# EAGLE design Pure Digit (EAGLE 9.6.2)

## Sheet 1 of 4: Microprocessor
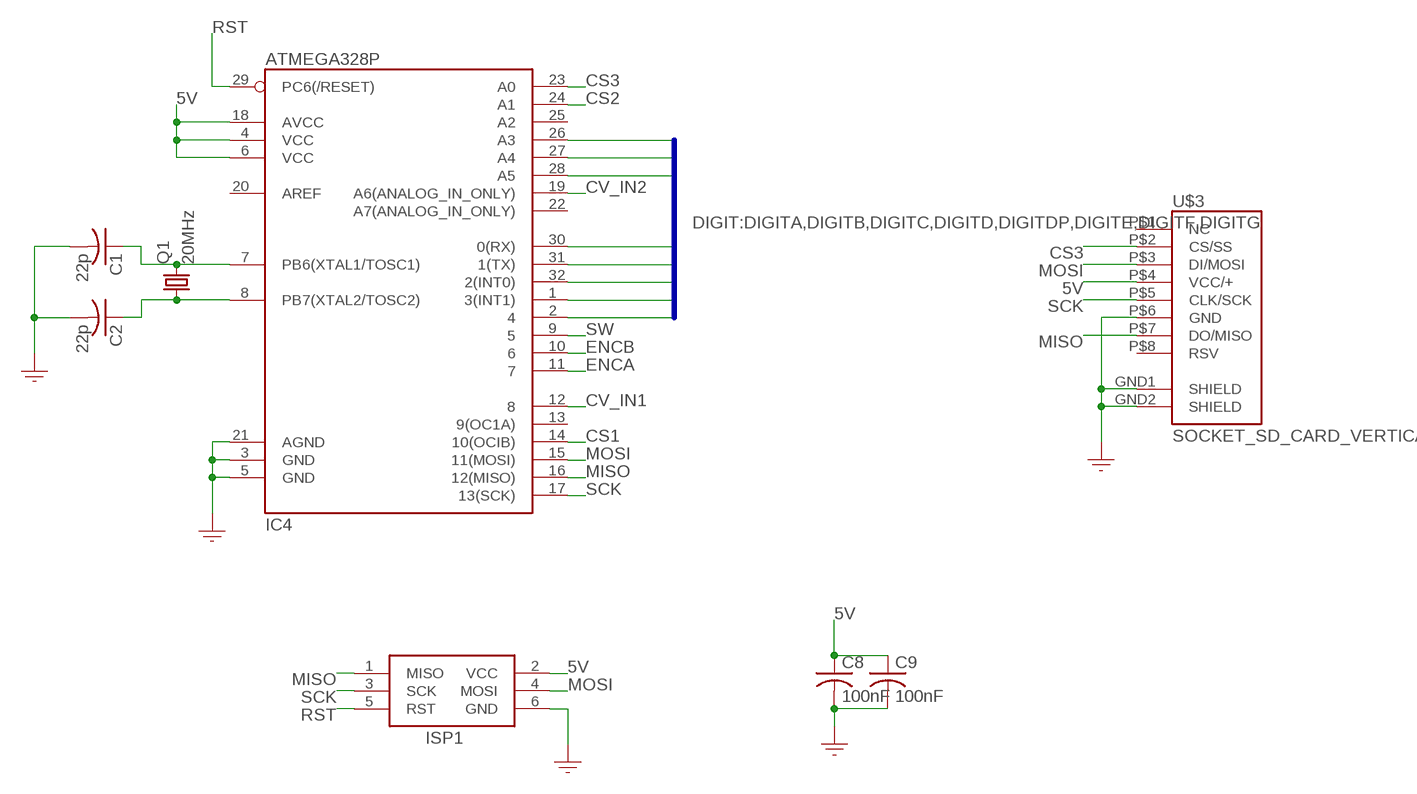
[diagram p0: schematic, sheet 1]

### Parts
C1  22p  CAPACITOR-USC0805  [C0805]
C2  22p  CAPACITOR-USC0805  [C0805]
C8  100nF  CAPACITOR-USC0805  [C0805]
C9  100nF  CAPACITOR-USC0805  [C0805]
IC4  ATMEGA328P  MICROPROCESSOR_ATMEGA328_SMT  [TQFP32-08]
ISP1  HEADER2X3-6  [AVRISP]
Q1  20MHz  CRYSTALSM49  [SM49]
U$3  SOCKET_SD_CARD_VERTICAL  [PJS008U-3000]

### Nets
5V: C8.1 C9.1 IC4.4(VCC) IC4.6(VCC) IC4.18(AVCC) ISP1.2(VCC) U$3.P$4(VCC/+) ; also sheet 2,3,4
CS1: IC4.14(10(OCIB)) ; also sheet 4
CS2: IC4.24(A1) ; also sheet 3
CS3: IC4.23(A0) U$3.P$2(CS/SS)
CV_IN1: IC4.12 ; also sheet 3
CV_IN2: IC4.19(A6(ANALOG_IN_ONLY)) ; also sheet 3
DIGITA: IC4.30(0(RX)) ; also sheet 4
DIGITB: IC4.28(A5) ; also sheet 4
DIGITC: IC4.27(A4) ; also sheet 4
DIGITD: IC4.26(A3) ; also sheet 4
DIGITDP: IC4.1(3(INT1)) ; also sheet 4
DIGITE: IC4.2 ; also sheet 4
DIGITF: IC4.32(2(INT0)) ; also sheet 4
DIGITG: IC4.31(1(TX)) ; also sheet 4
ENCA: IC4.11 ; also sheet 3
ENCB: IC4.10 ; also sheet 3
GND: C1.2 C2.2 C8.2 C9.2 IC4.3(GND) IC4.5(GND) IC4.21(AGND) ISP1.6(GND) U$3.GND1(SHIELD) U$3.GND2(SHIELD) U$3.P$6(GND) ; also sheet 2,3,4
MISO: IC4.16(12(MISO)) ISP1.1(MISO) U$3.P$7(DO/MISO) ; also sheet 3
MOSI: IC4.15(11(MOSI)) ISP1.4(MOSI) U$3.P$3(DI/MOSI) ; also sheet 3,4
N$1: C1.1 IC4.7(PB6(XTAL1/TOSC1)) Q1.2
N$2: C2.1 IC4.8(PB7(XTAL2/TOSC2)) Q1.1
RST: IC4.29(PC6(/RESET)) ISP1.5(RST)
SCK: IC4.17(13(SCK)) ISP1.3(SCK) U$3.P$5(CLK/SCK) ; also sheet 3,4
SW: IC4.9 ; also sheet 3
Unconnected: IC4.13(9(OC1A)) IC4.20(AREF) IC4.22(A7(ANALOG_IN_ONLY)) IC4.25(A2) U$3.P$1(NC) U$3.P$8(RSV)

### Buses
DIGIT:DIGITA,DIGITB,DIGITC,DIGITD,DIGITDP,DIGITE,DIGITF,DIGITG

## Sheet 2 of 4: Power
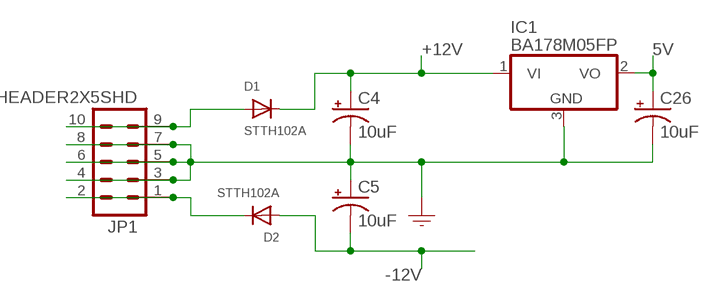
[diagram p1: schematic, sheet 2]

### Parts
C4  10uF  CAPACITOR_POL-US153CLV-0505  [153CLV-0505]
C5  10uF  CAPACITOR_POL-US153CLV-0505  [153CLV-0505]
C26  10uF  CAPACITOR_POL-US153CLV-0505  [153CLV-0505]
D1  STTH102A  DIODESMA  [SMADIODE]
D2  STTH102A  DIODESMA  [SMADIODE]
IC1  BA178M05FP  VOLTAGE_REG_POS05DT  [TO252]
JP1  HEADER2X5SHD  [2X5-SHROUDED]

### Nets
5V: C26.+ IC1.2(VO) ; also sheet 1,3,4
+12V: C4.+ D1.C IC1.1(VI) ; also sheet 3
-12V: C5.- D2.A ; also sheet 3
GND: C4.- C5.+ C26.- IC1.3(GND) JP1.3 JP1.4 JP1.5 JP1.6 JP1.7 JP1.8 ; also sheet 1,3,4
N$9: D1.A JP1.9 JP1.10
N$10: D2.C JP1.1 JP1.2

## Sheet 3 of 4: Inputs
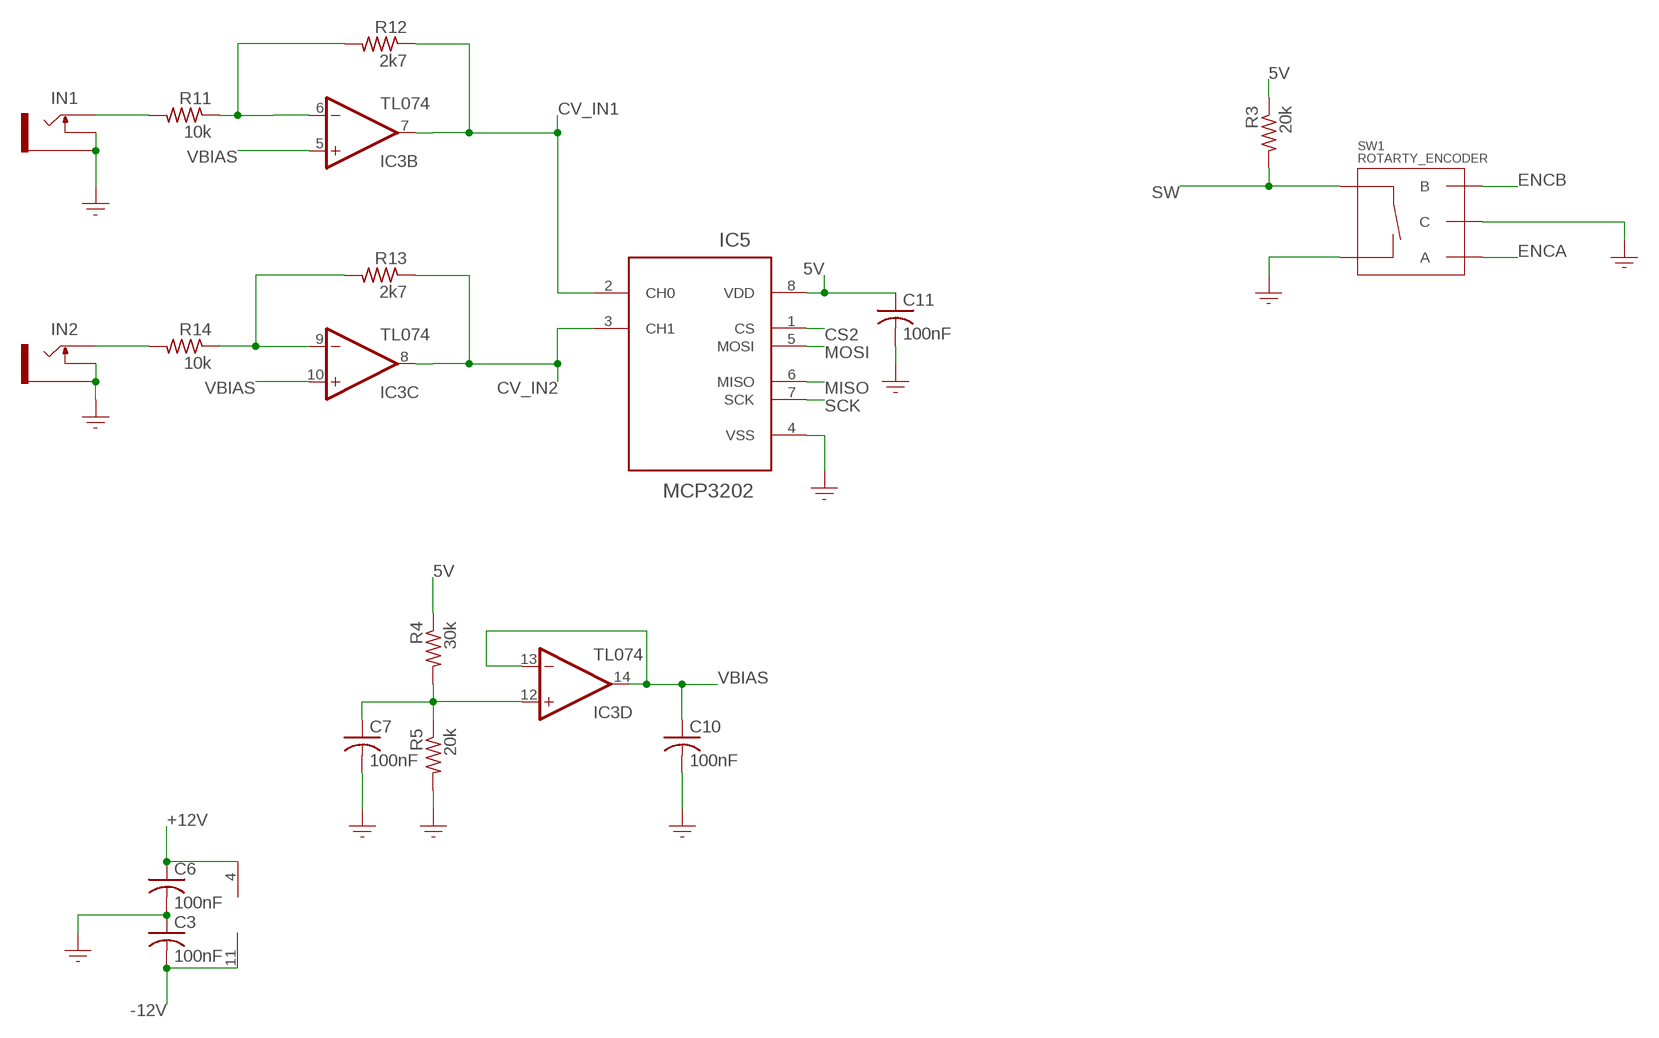
[diagram p2: schematic, sheet 3]

### Parts
C3  100nF  CAPACITOR-USC0805  [C0805]
C6  100nF  CAPACITOR-USC0805  [C0805]
C7  100nF  CAPACITOR-USC0805  [C0805]
C10  100nF  CAPACITOR-USC0805  [C0805]
C11  100nF  CAPACITOR-USC0805  [C0805]
IC3  TL074  OPAMP_QUADD  [SO14]
IC5  MCP3202  ADC_DUAL_12B_MCP3202  [SOIC--8]
IN1  PJ301M-12  SOCKET_MONO_3.5MMPJ301M-12  [PJ301M-12]
IN2  PJ301M-12  SOCKET_MONO_3.5MMPJ301M-12  [PJ301M-12]
R3  20k  RESISTOR_USR0805  [R0805]
R4  30k  RESISTOR_USR0805  [R0805]
R5  20k  RESISTOR_USR0805  [R0805]
R11  10k  RESISTOR_USR0805  [R0805]
R12  2k7  RESISTOR_USR0805  [R0805]
R13  2k7  RESISTOR_USR0805  [R0805]
R14  10k  RESISTOR_USR0805  [R0805]
SW1  ROTARTY_ENCODER  [ROTARY_ENC_PLAIN]

### Nets
5V: C11.1 IC5.8(VDD) R3.1 R4.1 ; also sheet 1,2,4
+12V: C6.1 IC3.4(P:V+) ; also sheet 2
-12V: C3.2 IC3.11(P:V-) ; also sheet 2
CS2: IC5.1(CS) ; also sheet 1
CV_IN1: IC3.7(B:OUT) IC5.2(CH0) R12.1 ; also sheet 1
CV_IN2: IC3.8(C:OUT) IC5.3(CH1) R13.1 ; also sheet 1
ENCA: SW1.A ; also sheet 1
ENCB: SW1.B ; also sheet 1
GND: C3.1 C6.2 C7.2 C10.2 C11.2 IC5.4(VSS) IN1.GND(SLEEVE) IN1.NORM(SWITCH) IN2.GND(SLEEVE) IN2.NORM(SWITCH) R5.2 SW1.C SW1.SW- ; also sheet 1,2,4
MISO: IC5.6(MISO) ; also sheet 1
MOSI: IC5.5(MOSI) ; also sheet 1,4
N$8: IN1.TIP R11.2
N$11: IN2.TIP R14.2
N$12: C7.1 IC3.12(D:+IN) R4.2 R5.1
N$20: IC3.6(B:-IN) R11.1 R12.2
N$24: IC3.9(C:-IN) R13.2 R14.1
SCK: IC5.7(SCK) ; also sheet 1,4
SW: R3.2 SW1.SW+ ; also sheet 1
VBIAS: C10.1 IC3.5(B:+IN) IC3.10(C:+IN) IC3.13(D:-IN) IC3.14(D:OUT)

## Sheet 4 of 4: Outputs
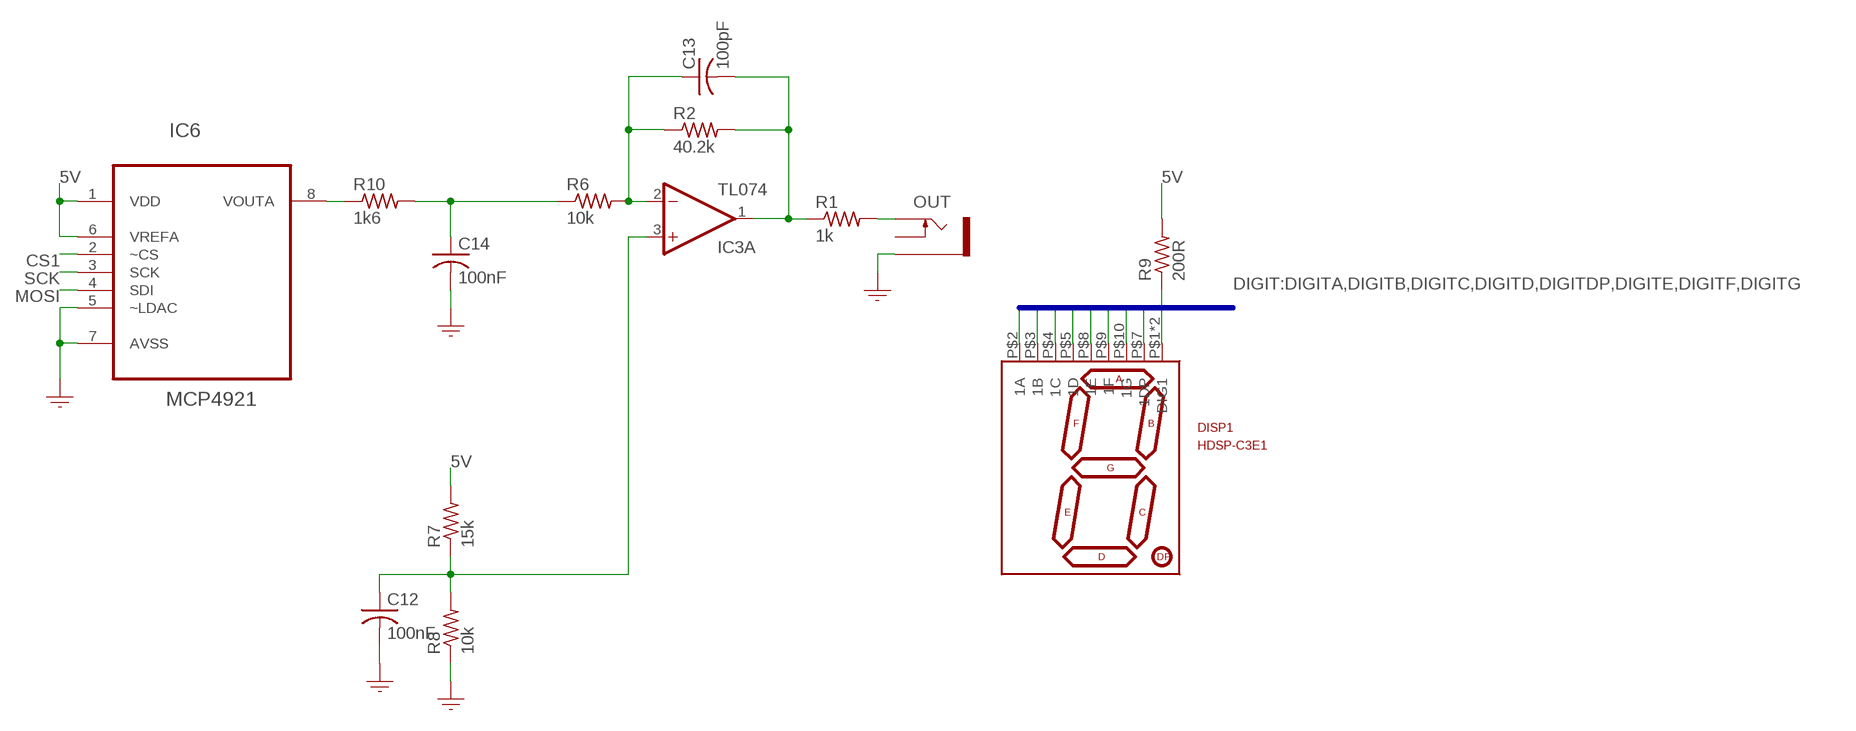
[diagram p3: schematic, sheet 4]

### Parts
C12  100nF  CAPACITOR-USC0805  [C0805]
C13  100pF  CAPACITOR-USC0805  [C0805]
C14  100nF  CAPACITOR-USC0805  [C0805]
DISP1  HDSP-C3E1  DISPLAY_7-SEGMENT-1DIGIT  [7-SEGMENT-1DIGIT]
IC6  MCP4921  DAC_SINGLE_12B_MCP4921  [SOIC8]
OUT  PJ301M-12  SOCKET_MONO_3.5MMPJ301M-12  [PJ301M-12]
R1  1k  RESISTOR_USR0805  [R0805]
R2  40.2k  RESISTOR_USR0805  [R0805]
R6  10k  RESISTOR_USR0805  [R0805]
R7  15k  RESISTOR_USR0805  [R0805]
R8  10k  RESISTOR_USR0805  [R0805]
R9  200R  RESISTOR_USR0805  [R0805]
R10  1k6  RESISTOR_USR0805  [R0805]

### Nets
5V: IC6.1(VDD) IC6.6(VREFA) R7.2 R9.2 ; also sheet 1,2,3
CS1: IC6.2(~CS) ; also sheet 1
DIGITA: DISP1.P$2(1A) ; also sheet 1
DIGITB: DISP1.P$3(1B) ; also sheet 1
DIGITC: DISP1.P$4(1C) ; also sheet 1
DIGITD: DISP1.P$5(1D) ; also sheet 1
DIGITDP: DISP1.P$7(1DP) ; also sheet 1
DIGITE: DISP1.P$8(1E) ; also sheet 1
DIGITF: DISP1.P$9(1F) ; also sheet 1
DIGITG: DISP1.P$10(1G) ; also sheet 1
GND: C12.2 C14.2 IC6.5(~LDAC) IC6.7(AVSS) OUT.GND(SLEEVE) R8.1 ; also sheet 1,2,3
MOSI: IC6.4(SDI) ; also sheet 1,3
N$3: C12.1 IC3.3(A:+IN) R7.1 R8.2
N$4: C13.2 IC3.1(A:OUT) R1.1 R2.2
N$5: OUT.TIP R1.2
N$6: C14.1 R6.1 R10.2
N$7: C13.1 IC3.2(A:-IN) R2.1 R6.2
N$13: DISP1.P$1(DIG1) DISP1.P$6(DIG1) R9.1
N$14: IC6.8(VOUTA) R10.1
SCK: IC6.3(SCK) ; also sheet 1,3
Unconnected: OUT.NORM(SWITCH)

### Buses
DIGIT:DIGITA,DIGITB,DIGITC,DIGITD,DIGITDP,DIGITE,DIGITF,DIGITG

## Library data of the parts
C1-C3 C6-C14 = GMSN:CAPACITOR-US: Capacitor; SORT: 3
C4 C5 C26 = GMSN:CAPACITOR_POL-US: Electro Capacitor; SORT: 3
D1 D2 = GMSN:DIODE: Diode SMADIODE - SMA Surface Mount Package 20V 1A Schottky Diode Digikey: 641-1014-6-ND DO-1N4148 - Through Hole Small Current Diode SOD-123 20V 1 A (.5mV Vf) Schottky Diode - Digikey: MBRX120TPMSCT-ND SOD-323 10V 570mA (.38mV Vf, 3ns) Schottky Diode - Digikey: ZLLS410CT-ND SOD-523 30V 30mA Schottky Diode (RB751S-40TE61) - Digikey: RB751S-40TE61CT-ND SOT23-R/W - SOT23 Package (R = Solder Paste/Reflow Ovens, W = Hand-Soldering) BAT54Film 40V 300mA - Digikey: 497-7162-1-ND; SORT: 3.9
DISP1 = GMSN:DISPLAY_7-SEGMENT-1DIGIT: 1 Digit 7 Segment Display - Common Anode; SORT: 9
IC1 = GMSN:VOLTAGE_REG_POS: Positive Voltage Regulator Added bigger pads to the TO-92 package; SORT: 4
IC3 = GMSN:OPAMP_QUAD: OP AMP; SORT: 4.5
IC4 = GMSN:MICROPROCESSOR_ATMEGA328_SMT: 32-Pin ATMEGA328 Commonly used on Arduino compatible boards Available in QFP and QFN packages TQFP is IC-09069 QFN is non-stock; SORT: 4
IC5 = GMSN:ADC_DUAL_12B_MCP3202: 12bit 2Ch ADC; SORT: 4
IC6 = GMSN:DAC_SINGLE_12B_MCP4921: 12bit DAC; SORT: 4
IN1 IN2 OUT = GMSN:SOCKET_MONO_3.5MM: 3.5 mm Jack Socket; SORT: 8
ISP1 = GMSN:HEADER2X3: AVR ISP Header Standard 6 pin header for AVR programming; SORT: 7
JP1 = GMSN:HEADER2X5: Header 5x2 Standard 10-pin dual row 0.1" header. Commonly used with AVR-ISP. Use with Spark Fun Electronics SKU: PRT-00778; SORT: 7
Q1 = GMSN:CRYSTAL: Crystal; SORT: 6
R1-R14 = GMSN:RESISTOR_US: Resistor; SORT: 2
SW1 = GMSN:ROTARTY_ENCODER: Simple no LED rotary encoder Example: COM-09117; SORT: 8
U$3 = GMSN:SOCKET_SD_CARD_VERTICAL

## Board
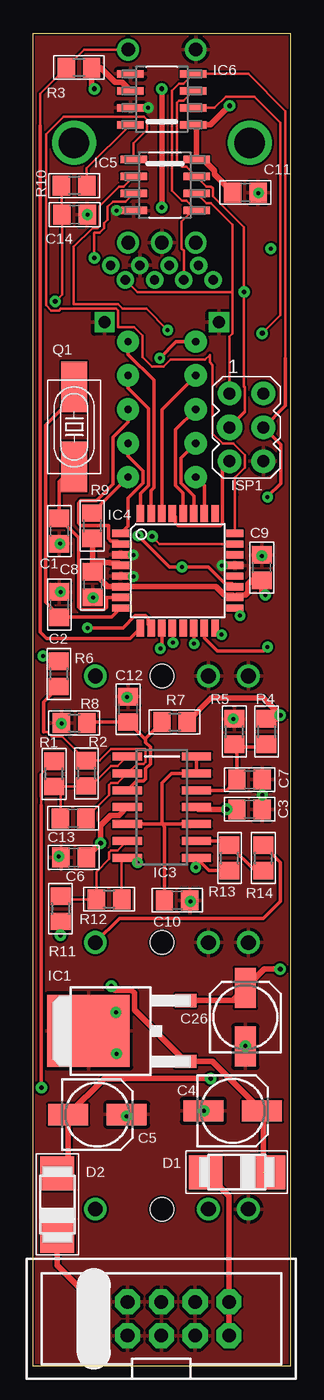
[diagram p4: board, top side]
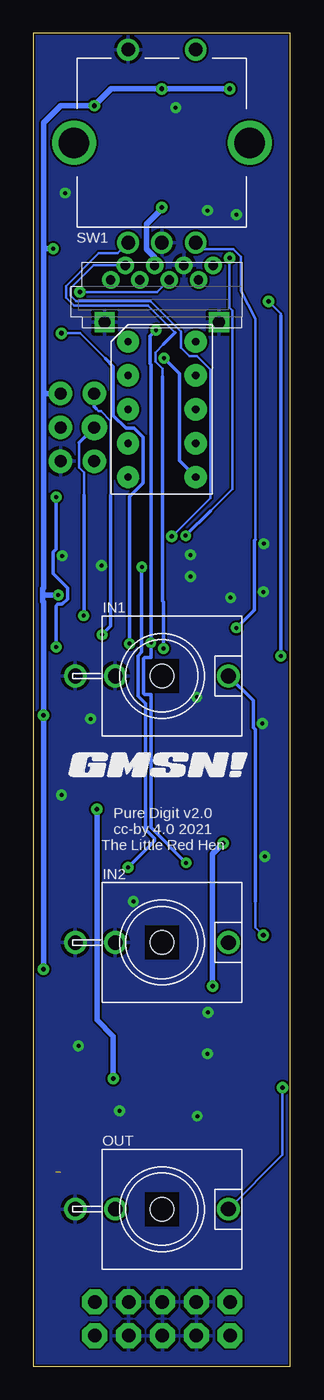
[diagram p5: board, bottom side, seen from below]

Size 19.32 x 99.99 mm. Coordinates in mm from the lower left corner, seen from the top.
Outline: 19.32,0 0,0 0,99.99 19.32,99.99 19.32,0
Copper layers (1*16): Top 0.035mm / dielectric 1.5mm / Bottom 0.035mm
Design rules "PCBWay": minimum track width 6mil, minimum drill 12mil, track to track 6mil, track to pad 6mil, pad to pad 6mil, via to via 6mil, smd to smd 6mil, copper to edge 6mil, drill to drill 6mil, minimum pad ring 12mil, minimum via ring 10mil, stop-mask expansion 4mil, vias tented up to drill 25mil, thermal gap 10mil

### Footprints (pad centres in the part's own frame; a part is rotated, then mirrored left to right if it is on the bottom)
C0805 = smd 1.3 x 1.5: 1 -0.95,0; 2 0.95,0
153CLV-0505 = smd 3 x 1.6: + 2.2,0; - -2.2,0
SMADIODE = smd 2.54 x 2.54: A 2.349,0; C -2.349,0
7-SEGMENT-1DIGIT = drill 0.55 pad 1.676: P$1 -2.54,5.08; P$2 -2.54,2.54; P$3 -2.54,0; P$4 -2.54,-2.54; P$5 -2.54,-5.08; P$6 2.54,-5.08; P$7 2.54,-2.54; P$8 2.54,0; P$9 2.54,2.54; P$10 2.54,5.08
TO252 = smd 1 x 1.6: 1 -2.28,-4.8; 2 2.28,-4.8 | smd 5.4 x 6.2: 3 0,2.5
SO14 = smd 0.6 x 2.2: 1 -3.81,-2.6; 2 -2.54,-2.6; 3 -1.27,-2.6; 4 0,-2.6; 5 1.27,-2.6; 6 2.54,-2.6; 7 3.81,-2.6; 8 3.81,2.6; 9 2.54,2.6; 10 1.27,2.6; 11 0,2.6; 12 -1.27,2.6; 13 -2.54,2.6; 14 -3.81,2.6
TQFP32-08 = smd 1.27 x 0.559: 1 -4.293,2.8; 2 -4.293,2; 3 -4.293,1.2; 4 -4.293,0.4; 5 -4.293,-0.4; 6 -4.293,-1.2; 7 -4.293,-2; 8 -4.293,-2.8; 17 4.293,-2.8; 18 4.293,-2; 19 4.293,-1.2; 20 4.293,-0.4; 21 4.293,0.4; 22 4.293,1.2; 23 4.293,2; 24 4.293,2.8 | smd 0.559 x 1.27: 9 -2.8,-4.293; 10 -2,-4.293; 11 -1.2,-4.293; 12 -0.4,-4.293; 13 0.4,-4.293; 14 1.2,-4.293; 15 2,-4.293; 16 2.8,-4.293; 25 2.8,4.293; 26 2,4.293; 27 1.2,4.293; 28 0.4,4.293; 29 -0.4,4.293; 30 -1.2,4.293; 31 -2,4.293; 32 -2.8,4.293
SOIC--8 = smd 1.981 x 0.559: 1 -2.362,1.905; 2 -2.362,0.635; 3 -2.362,-0.635; 4 -2.362,-1.905; 5 2.362,-1.905; 6 2.362,-0.635; 7 2.362,0.635; 8 2.362,1.905
SOIC8 = smd 1.981 x 0.559: 1 -2.362,1.905; 2 -2.362,0.635; 3 -2.362,-0.635; 4 -2.362,-1.905; 5 2.362,-1.905; 6 2.362,-0.635; 7 2.362,0.635; 8 2.362,1.905
PJ301M-12 = drill 1.1: GND 0,-6.5; NORM 0,-3.5; TIP 0,5 | hole 1.778: 0,0
AVRISP = drill 0.9 pad 1.778: 1 -1.27,2.54; 2 1.27,2.54; 4 1.27,0; 5 -1.27,-2.54; 6 1.27,-2.54 | drill 0.9 pad 1.93: 3 -1.27,0
2X5-SHROUDED = drill 1.016 pad 1.88 octagon: 1 -1.27,5.08; 2 1.27,5.08; 3 -1.27,2.54; 4 1.27,2.54; 5 -1.27,0; 6 1.27,0; 7 -1.27,-2.54; 8 1.27,-2.54; 9 -1.27,-5.08; 10 1.27,-5.08
SM49 = smd 3.81 x 1.93: 1 -3,0; 2 3,0
R0805 = smd 1.3 x 1.5: 1 -0.95,0; 2 0.95,0
ROTARY_ENC_PLAIN = drill 1.016: A 7.493,-2.54; B 7.493,2.54; C 7.493,0; SW+ -6.985,2.54; SW- -6.985,-2.54 | drill 2.286: P$3 0,6.604; P$4 0,-6.604
PJS008U-3000 = drill 0.9 square: GND1 -4.3,-1.519; GND2 4.3,-1.519 | drill 0.7: P$1 -3.85,1.651; P$2 -2.75,2.751; P$3 -1.65,1.651; P$4 -0.55,2.751; P$5 0.55,1.651; P$6 1.65,2.751; P$7 2.75,1.651; P$8 3.85,2.751

### Placement (x,y rotation side)
C1  1.96,62.65 270 top
C2  1.96,57.13 90 top
C3  16.25,41.78 180 top
C4  14.98,19.15 0 top
C5  4.82,18.88 0 top
C6  3.03,38.16 180 top
C7  16.25,44 0 top
C8  4.46,58.64 270 top
C9  17.16,59.91 90 top
C10  10.81,34.95 0 top
C11  15.93,88.05 0 top
C12  7.12,49.28 90 top
C13  2.99,41.1 180 top
C14  3.11,86.38 0 top
C26  15.93,26.18 90 top
D1  15.3,14.55 180 top
D2  1.8,12.13 90 top
DISP1  9.66,71.78 0 bottom
IC1  6.64,25.15 90 top
IC3  9.66,41.93 270 top
IC4  10.85,59.67 0 top
IC5  9.9,88.61 0 top
IC6  9.66,95.04 180 top
IN1  9.66,51.78 270 bottom
IN2  9.66,31.78 270 bottom
ISP1  16.01,70.43 0 top
JP1  9.62,3.56 90 top
OUT  9.66,11.78 270 bottom
Q1  3.07,70.47 270 top
R1  1.56,44.43 90 top
R2  3.98,44.47 270 top
R3  3.43,97.42 180 top
R4  17.52,47.61 270 top
R5  15.1,47.61 90 top
R6  1.92,51.94 270 top
R7  10.61,48.32 0 top
R8  3.07,48.24 0 top
R9  4.42,63.05 270 top
R10  3.07,88.57 180 top
R11  2.04,34.31 270 top
R12  5.69,35.03 180 top
R13  14.74,38.12 90 top
R14  17.28,38.12 90 top
SW1  9.66,91.78 270 bottom
U$1  [GMSN!_LOGO]  9.66,45.03 0 bottom
U$3  9.66,79.83 0 bottom

### Tracks (layer width: path | path; a pad name or v marks a point on that pad's centre or on a via)
5V  (via drill 0.3, 0.35)
  Top 0.406: R9.2 4.46,62.06 4.46,60.27 | 4.46,60.27 C8.1 5.36,58.7 5.57,58.49 5.58,58.47 IC4.6 7.94,58.47 7.96,58.49 13.71,58.49 14.36,57.84 14.98,57.84 IC4.18 15.31,57.84 15.93,57.84 16.13,58.05 16.13,58.67 16.43,58.96 C9.1 17.16,58.13 v17.44,57.85 | IC4.4 6.39,60.24 5.78,60.24 5.75,60.27 4.46,60.27 | R4.1 18.27,48.56 v18.55,48.84 17.28,50.11 13.35,50.11 R7.2 | IC1.2 14.98,27.43 C26.+ 17.34,29.79 v18.55,29.79 | v14.74,94.56 13.31,93.13 IC6.1 12.26,92.89 IC5.8 12.76,90.51 13.61,89.67 13.61,89.42 C11.1 | IC6.6 6.66,96.31 6.16,96.31 5.05,97.42 R3.1 4.38,96.03 v4.58,95.83 | v9.66,86.94 v9.66,95.83
  Bottom 0.254: 18.55,57.85 18.55,58.28 18.61,58.33
  Bottom 0.406: v18.55,29.79 v18.55,48.84 18.55,57.31 18.61,57.37 18.61,58.33 18.55,58.39 18.55,72.97 | 18.55,72.97 18.55,83.92 | 18.55,83.92 18.55,93.29 17.28,94.56 v14.74,94.56 13.47,95.83 v9.66,95.83 v4.58,95.83 | 18.55,72.97 ISP1.2 | v17.84,83.84 18.47,83.84 18.55,83.92 | v17.44,57.85 18.55,57.85 | v9.66,86.94 9.66,86.84 10.83,85.67 10.83,83.8 10.21,83.19 U$3.P$4
+12V  (via drill 0.35)  (1 unrouted)
  Top 0.406: IC3.4 6.45,41.32 5.81,41.32 5.06,40.56 v5.06,39.24 C6.1 | v5.85,28.52 6.17,28.2 7.39,28.2 7.6,27.99 7.6,26.71 IC1.1 13.46,22.87 C4.+ 17.28,19.05 17.28,14.55
  Bottom 0.406: v5.85,28.52 5.85,31.26 5.87,31.28 5.87,38.42 v5.06,39.24
-12V  (via drill 0.35)
  Top 0.406: C3.2 v14.54,41.78 12.42,41.78 IC3.11 | D2.A 2.62,15.3 C5.- 5.31,21.57 6.84,21.57 6.84,21.58 v13.31,21.58
  Bottom 0.406: v14.54,41.78 14.54,25.98 13.31,24.75 v13.31,21.58
CS1  (via drill 0.3, 0.35)
  Top 0.2: IC6.2 13.62,94.4 14.46,95.24 16.6,95.24 18.55,93.29 18.55,78.84 v17.2,77.49
  Top 0.254: v12.08,54.2 12.08,55.35 IC4.14
  Bottom 0.2: 13.91,75.59 15.81,77.49 v17.2,77.49
  Bottom 0.254: 13.91,75.59 13.32,75 13.32,71.32 12.36,70.36 11.74,70.36 11.08,69.7 11.08,66.24 12.08,65.24 v12.08,54.2
CS2
  Top 0.2: 15.14,65.35 15.14,66.68 15.88,67.42 15.88,68.36 15.03,69.21 14.24,69.21 13.47,69.98 13.47,71.7 | 13.25,75.86 12.9,75.51 10.31,75.51 9.77,74.97 8.93,74.97 8.21,75.69 8.21,77.31 7.57,77.95 6.37,77.95 6.37,79.17 6.22,79.32 2.05,79.32 1.92,79.19 1.36,79.19 0.96,79.59 0.96,92.41 2.28,93.73 8.33,93.73 8.54,93.52 8.54,92.75 7.54,91.74 IC5.1
  Top 0.203: IC4.24 15.14,65.35 | 13.25,75.86 13.25,75.32 13.47,75.09 13.47,71.7
CS3  (via drill 0.35)
  Top 0.2: IC4.23 9.49,61.67 v8.92,62.25
  Bottom 0.2: v8.92,62.25 6.03,65.14 6.03,74.77 7.03,75.77 7.57,75.77 8.21,76.41 8.21,77.61 10.51,79.91 16.11,79.91 16.51,80.31 16.51,80.87 14.8,82.58 U$3.P$2
CV_IN1  (via drill 0.3)
  Top 0.2: R12.1 6.64,37.84 6.92,38.12 | v10.1,77.73 8.51,79.32 6.72,79.32 6.37,79.67 3.04,79.67 3.04,83.98 4.45,85.38 4.82,85.38 4.96,85.53 4.96,87.03 6.44,88.5 6.8,88.5 IC5.2
  Top 0.254: 6.92,38.12 IC3.7 7.48,38.12 v7.83,37.77 | v10.49,54.28 10.49,55.34 IC4.12
  Bottom 0.254: v7.83,37.77 10.49,40.43 10.49,50.38 10.98,50.38 11.06,50.46 11.06,53.1 10.98,53.18 10.49,53.18 v10.49,54.28 10.49,59.66 10.48,59.67 10.48,75.15 10.54,75.2 10.54,77.29 v10.1,77.73
CV_IN2  (via drill 0.3, 0.35)
  Top 0.2: v4.58,83.13 4.58,85.02 4.59,85.03 4.96,85.03 5.32,85.38 5.32,85.75 5.59,86.03 5.59,86.97 5.97,87.36 6.92,87.36 IC5.3
  Top 0.254: R13.1 13.21,37.17 12.39,38 | 12.39,38 IC3.8 | IC4.19 14.9,58.72 14.39,58.72 13.16,59.95 v11.17,59.95 10.22,59.95 v7.87,62.29 | v12.2,37.41 12.39,37.6 12.39,38
  Bottom 0.2: v4.58,83.13 4.58,79.4 4.35,79.17 4.35,65.81 6,64.17
  Bottom 0.254: v7.87,62.29 6,64.17 | v12.2,37.41 10.22,39.39 10.22,39.57 10.9,40.26 10.9,49.72 11.46,50.29 11.46,53.27 11.18,53.56 v11.18,59.94 v11.17,59.95
DIGITA
  Top 0.254: DISP1.P$2 9.65,71.77 IC4.30
DIGITB
  Top 0.254: IC4.28 11.25,65.49 10.68,66.07 10.68,70.26 DISP1.P$3
DIGITC
  Top 0.254: IC4.27 12.05,65.27 11.08,66.24 11.08,68.12 DISP1.P$4
DIGITD
  Top 0.254: IC4.26 12.85,66.05 DISP1.P$5
DIGITDP
  Top 0.254: IC4.1 7.12,63.04 7.12,65.12 8.24,66.24 8.24,67.16 7.12,68.28 DISP1.P$7
DIGITE
  Top 0.254: DISP1.P$8 7.12,70.82 6,69.7 6,66.16 4.77,64.93 3.56,64.93 3.39,64.76 3.39,63.23 3.56,63.07 5.64,63.07 5.64,62.08 5.81,61.92 6.32,61.92 IC4.2
DIGITF
  Top 0.254: DISP1.P$9 7.12,73.36 8.64,71.84 8.64,66.07 8.05,65.47 IC4.32
DIGITG
  Top 0.254: DISP1.P$10 7.12,75.9 9.05,73.97 9.05,65.9 8.85,65.7 IC4.31
ENCA  (via drill 0.3)
  Top 0.254: v9.54,53.84 9.65,53.95 IC4.11
  Bottom 0.2: 9.63,74.24 9.63,74.83 10.16,75.36 10.16,76.04 9.54,76.66 | SW1.A 12.99,83.49 14.4,83.49 16.87,81.02 16.87,80.16 16.26,79.56 10.69,79.56 8.67,77.53
  Bottom 0.254: v9.54,53.84 9.54,57.32 9.63,57.41 9.63,74.24 | 9.54,76.66 8.67,77.53 | SW1.A
ENCB  (via drill 0.3)
  Top 0.254: v4.06,55.39 6.75,55.39 7.65,56.3 8.45,56.3 8.61,56.13 8.61,55.62 IC4.10
  Bottom 0.2: 2.63,62.03 2.63,78.59 3.74,80.69 3.74,83.25 4.3,83.81 6.64,83.81 SW1.B
  Bottom 0.254: 2.63,62.03 2.72,61.94 2.72,56.73 v4.06,55.39
GND  (via drill 0.3)
  other vias: 11.8,34.87 1.92,38.24 17.2,42.85 15.02,48.56 7.04,50.19 2.12,48.2 2.04,58.09 4.5,57.65 17.16,60.79 2,61.7 16.92,88.01 8.63,94.4 6.25,86.7 7.52,60.87 7.52,59.24 14.18,60.07 15.93,24.04 12.84,19.15 7,18.76 6.21,26.54 6.25,23.44 4.06,86.38
  pour Bottom: 0.77,102.18 19.82,102.18 19.82,-3.23 -0.5,-3.23 -0.5,102.18
  pour Top: -0.5,102.18 21.09,102.18 21.09,-3.23 -0.5,-3.23
MISO  (via drill 0.3)
  Top 0.2: IC5.6 13,87.23 13.36,87.23 14.97,85.62 14.97,80.59 | ISP1.1 14.74,77.22 14.97,77.45 14.97,80.59 | U$3.P$7 7.82,80.57 14.95,80.57 14.97,80.59
  Top 0.254: v14.14,54.87 13.65,55.37 IC4.16
  Bottom 0.2: 14.6,71.84 14.41,71.65 14.24,71.65 13.5,70.91 13.5,65.35
  Bottom 0.254: ISP1.1 14.74,71.97 14.6,71.84 | 13.5,65.35 13.5,55.52 v14.14,54.87
MOSI  (via drill 0.3)
  Top 0.2: IC5.5 12.11,86.85 | 12.11,86.85 11.52,87.44 11.16,87.44 10.43,88.18 10.43,95.7 10.93,96.2 11.28,96.2 IC6.4 16.17,96.94 18.95,94.16 18.95,75.63 | U$3.P$3 11.31,83.67 11.13,83.85 11.13,85.88 12.11,86.85
  Top 0.254: ISP1.4 17.3,70.41 | 17.3,70.41 18.59,69.12 18.59,66.22 17.6,65.23 v17.6,65.19 | v17.6,53.96 17.28,53.64 13.83,53.64 12.85,54.62 IC4.15 | 18.95,75.63 18.95,72.06 17.3,70.41
  Bottom 0.254: v17.6,53.96 17.6,57.04 17.47,57.17 17.16,57.17 16.75,57.57 16.75,58.36 17.84,59.45 17.84,61.07 17.6,61.32 v17.6,65.19
N$1
  Top 0.254: IC4.7 5.49,57.67 5.49,56.93 5.33,56.76 3.59,56.76 3.39,56.97 3.39,62.17 C1.1 1.96,66.36 Q1.2
N$2
  Top 0.254: IC4.8 5.87,56.19 C2.1 1.96,56.29 0.93,57.32 0.93,70.59 3.31,72.97 3.31,73.23 Q1.1
N$3
  Top 0.254: R7.1 8.44,47.1 | IC3.3 7.75,43.9 8.28,43.9 8.44,44.06 8.44,44.83 8.79,45.18 8.79,46.44 8.44,46.79 8.44,47.1 | 8.44,47.1 8.35,47.1 C12.1 4.1,48.33 R8.2
N$4
  Top 0.2: C13.2 2.04,43.01 R1.1 3.95,43.48 R2.2 4.35,43.52 5.86,45.03 6.34,45.03 IC3.1
N$5  (via drill 0.35)
  Top 0.2: 0.6,42.09 0.6,42.69 0.56,42.73 0.56,44.38 R1.2
  Top 0.254: v0.6,20.9 0.6,42.09
  Bottom 0.2: OUT.TIP 0.6,15.84 v0.6,20.9
N$6  (via drill 0.3, 0.35)
  Top 0.2: v1.64,79.88 2.16,80.39 C14.1 2.12,86.42 R10.2
  Top 0.254: R6.1 1.13,52.89 v0.73,53.28
  Bottom 0.2: v1.64,79.88 0.73,78.96 0.73,78.8
  Bottom 0.254: v0.73,53.28 0.73,78.8
N$7
  Top 0.2: 0.77,47.57 1.04,47.57 1.37,47.24 2.17,47.24 R2.1 4.98,45.42 5.86,46.3 8.39,46.3 8.39,46.17 8.41,46.15 8.41,45.34 8.27,45.19 7.78,45.19 IC3.2 6.34,43.76 5.86,43.76 5.71,43.61 5.71,42.87 C13.1
  Top 0.254: R6.2 0.77,49.84 0.77,47.57
N$8  (via drill 0.35)
  Top 0.2: R11.2 v2.04,32.33
  Bottom 0.2: v2.04,32.33 2.63,32.93 2.63,34.87
  Bottom 0.254: 2.63,34.87 2.63,47.75 2.8,47.92 2.8,49.92 IN1.TIP
N$9
  Top 0.406: D1.A 14.7,12.8 JP1.10 JP1.9
N$10
  Top 0.406: JP1.1 JP1.2 1.8,7.57 D2.C
N$11
  Top 0.254: IN2.TIP 6.48,33.6 17.28,33.6 18.55,34.87 18.55,37.8 R14.2
N$12
  Top 0.254: 15.3,46.46 C7.1 14.5,43.2 IC3.12 | 15.3,46.46 R5.1 | R4.2 17.32,46.46 15.3,46.46
N$13  (via drill 0.3)
  Top 0.254: DISP1.P$6 R9.1 | v9.5,75.63 10.73,76.86 DISP1.P$1
  Bottom 0.254: DISP1.P$6 8.35,67.93 8.35,74.48 v9.5,75.63
N$14
  Top 0.2: R10.1 4.02,89.86 IC6.8
N$20
  Top 0.2: IC3.6 6.34,38.68 5.86,38.68 5.71,38.53 5.71,38.04 4.74,37.08 R12.2 2.28,35.03 R11.1
N$24
  Top 0.254: IC3.9 14.42,39.39 R13.2 16.64,37.17 R14.1
RST
  Top 0.254: IC4.29 10.69,63.73 10.69,63.22 10.86,63.05 14.05,63.05 14.21,63.22 14.21,67.36 ISP1.5
SCK  (via drill 0.3, 0.35)
  Top 0.2: 15.83,71.52 15.88,71.57 15.88,73.44 15.83,73.49 v15.83,80.59 15.83,85.44 13.5,87.77 13.5,88.36 13.36,88.5 13,88.5 IC5.7 11.52,89.98 11.16,89.98 10.78,90.37 10.78,94.78 10.93,94.93 11.28,94.93 IC6.3
  Top 0.254: v15.53,56.3 15.56,56.88 IC4.17 | ISP1.3 15.83,71.52
  Bottom 0.2: 15.49,65.35 15.49,67.03 15.88,67.42 15.88,69.27 15.89,69.28 | v15.83,80.59 14.74,80.59 | U$3.P$5 10.02,80.57 13.89,80.57 13.9,80.59 14.74,80.59 | 14.74,80.59 14.72,80.57
  Bottom 0.254: 15.89,69.28 ISP1.3 | 15.49,65.35 15.49,56.34 v15.53,56.3
SW
  Top 0.2: 0.52,93.05 0.52,95.46 R3.2 3.83,98.77 SW1.SW+
  Top 0.254: 0.52,93.05 0.52,55.08 1.01,54.59 7.26,54.59 IC4.9
VBIAS
  Top 0.254: IC3.5 9.66,40.66 | 9.66,40.66 IC3.10 | C10.1 9.86,40.46 9.66,40.66 | IC3.14 IC3.13 10.37,44.47 9.66,43.76 9.66,40.66

### Text on the board
bNames: Pure Digit v2.0 / cc-by 4.0 2021 / The Little Red Hen